# EAGLE board car (EAGLE 6.5.0)
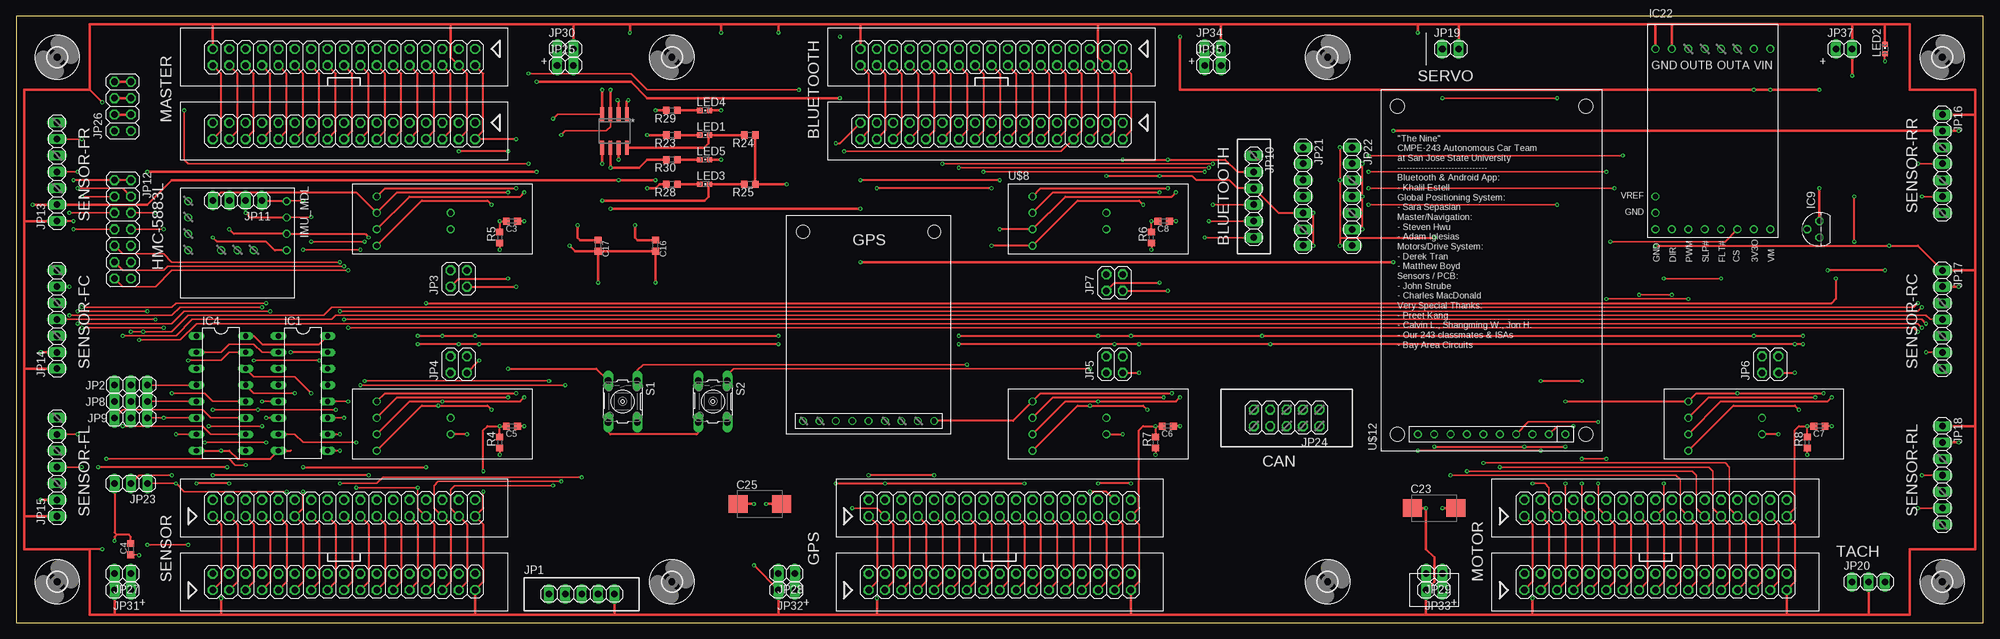
[diagram p5: board, top side]
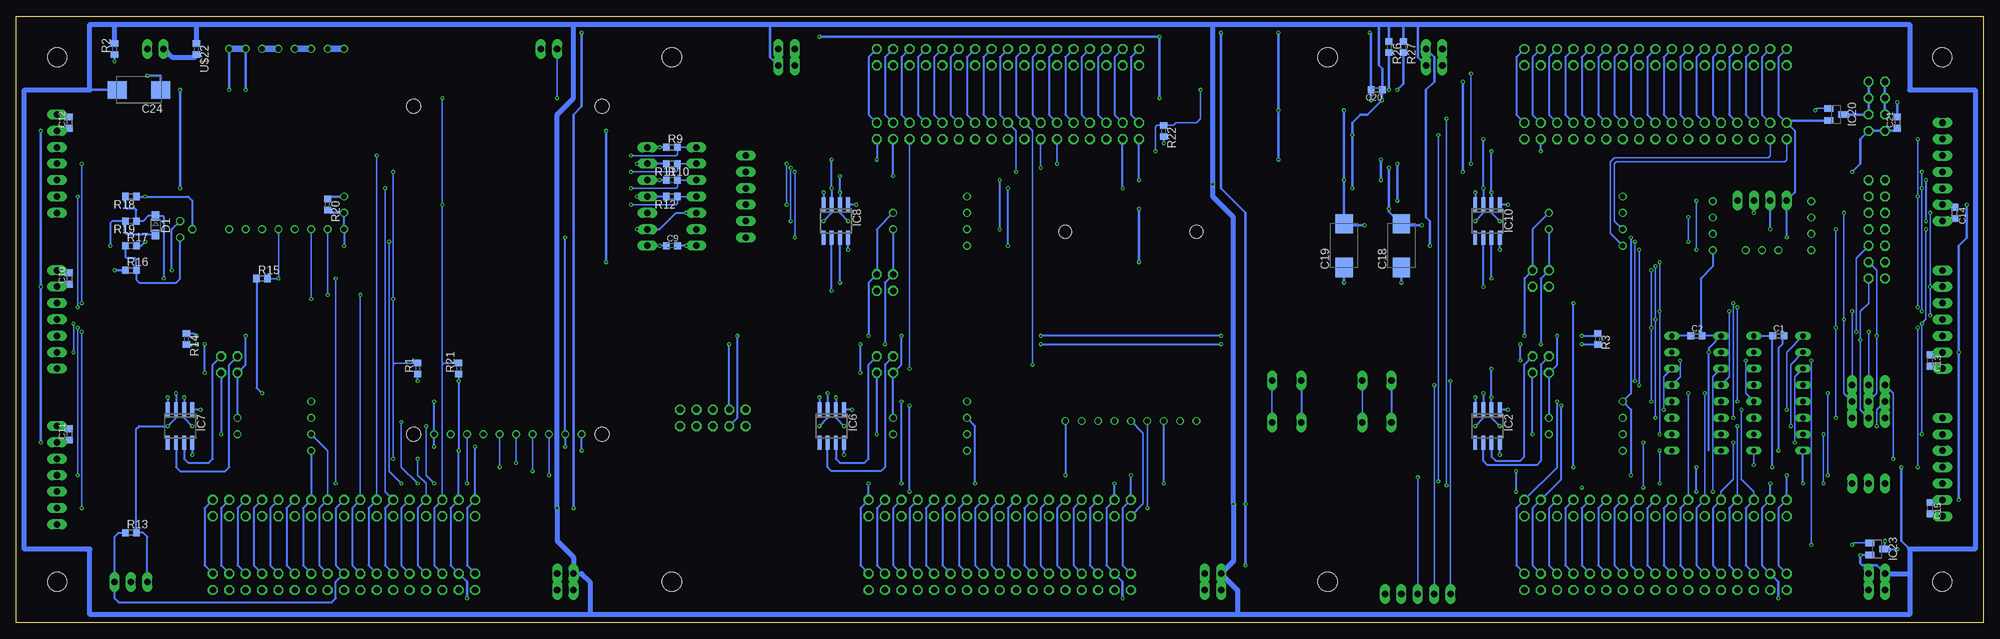
[diagram p6: board, bottom side, seen from below]

Size 304.8 x 93.98 mm. Coordinates in mm from the lower left corner, seen from the top.
Outline: 0,0 304.8,0 304.8,93.98 0,93.98 0,0
Copper layers (1*16): Top 0.0356mm / dielectric 1.5011mm / Bottom 0.0356mm
Design rules "LaenPCBOrder *": minimum track width 8mil, minimum drill 10mil, track to track 6mil, track to pad 6mil, pad to pad 6mil, via to via 6mil, smd to smd 6mil, copper to edge 15mil, drill to drill 6mil, minimum pad ring 7mil, minimum via ring 7mil, stop-mask expansion 3mil, vias tented up to drill 0mil, thermal gap 10mil

## Footprints (pad centres in the part's own frame; a part is rotated, then mirrored left to right if it is on the bottom)
C0603K = smd 1.05 x 1.08: 1 -0.875,0; 2 0.875,0
D/7343-31W = smd 2.95 x 2.7: + 3.375,0; - -3.375,0
SOD323-W = smd 1.5 x 1.2: A 1.45,0; C -1.45,0
3,0 = hole 3: 0,0
DIL16 = drill 0.813 long: 1 -8.89,-3.81; 2 -6.35,-3.81; 3 -3.81,-3.81; 4 -1.27,-3.81; 5 1.27,-3.81; 6 3.81,-3.81; 7 6.35,-3.81; 8 8.89,-3.81; 9 8.89,3.81; 10 6.35,3.81; 11 3.81,3.81; 12 1.27,3.81; 13 -1.27,3.81; 14 -3.81,3.81; 15 -6.35,3.81; 16 -8.89,3.81
SOIC8 = smd 0.6 x 2.2: 1 -1.905,-2.6; 2 -0.635,-2.6; 3 0.635,-2.6; 4 1.905,-2.6; 5 1.905,2.6; 6 0.635,2.6; 7 -0.635,2.6; 8 -1.905,2.6
TO-92 = drill 0.813 octagon: 1 -1.27,0; 2 0,1.905; 3 1.27,0
SOT23-3 = smd 1 x 1.4: 1 -0.95,-1.1; 2 0.95,-1.1; 3 0,1.1
24V21 = drill 0.813: 1 19.05,1.27; 2 16.51,1.27; 3 13.97,1.27; 4 11.43,1.27; 5 8.89,1.27; 6 6.35,1.27; 7 3.81,1.27; 8 1.27,1.27; 9 1.27,3.81; 10 1.27,6.35; 11 1.27,29.21; 12 3.81,29.21; 13 6.35,29.21; 14 8.89,29.21; 15 11.43,29.21; 16 13.97,29.21; 17 16.51,29.21; 18 19.05,29.21
MPU9250 = drill 0.813: P1 -2.461,8.255; P2 0.079,8.255; P3 2.619,8.255; P4 5.159,8.255; P5 5.159,3.175; P6 5.159,0.635; P7 5.159,-1.905; P8 5.159,-6.985; P9 2.619,-6.985; P10 0.079,-6.985; P11 -2.461,-6.985
1X05 = drill 1.016 long: 1 -5.08,0; 2 -2.54,0; 3 0,0; 4 2.54,0; 5 5.08,0
1X03 = drill 1.016 long: 1 -2.54,0; 2 0,0; 3 2.54,0
2X02 = drill 1.016 octagon: 1 -1.27,-1.27; 2 -1.27,1.27; 3 1.27,-1.27; 4 1.27,1.27
1X06 = drill 1.016 long: 1 -6.35,0; 2 -3.81,0; 3 -1.27,0; 4 1.27,0; 5 3.81,0; 6 6.35,0
1X04 = drill 1.016 long: 1 -3.81,0; 2 -1.27,0; 3 1.27,0; 4 3.81,0
2X07 = drill 1.016 octagon: 1 -7.62,-1.27; 2 -7.62,1.27; 3 -5.08,-1.27; 4 -5.08,1.27; 5 -2.54,-1.27; 6 -2.54,1.27; 7 0,-1.27; 8 0,1.27; 9 2.54,-1.27; 10 2.54,1.27; 11 5.08,-1.27; 12 5.08,1.27; 13 7.62,-1.27; 14 7.62,1.27
1X07 = drill 1.016 long: 1 -7.62,0; 2 -5.08,0; 3 -2.54,0; 4 0,0; 5 2.54,0; 6 5.08,0; 7 7.62,0
1X02 = drill 1.016 long: 1 -1.27,0; 2 1.27,0
2X05 = drill 1.016 octagon: 1 -5.08,-1.27; 2 -5.08,1.27; 3 -2.54,-1.27; 4 -2.54,1.27; 5 0,-1.27; 6 0,1.27; 7 2.54,-1.27; 8 2.54,1.27; 9 5.08,-1.27; 10 5.08,1.27
2X04 = drill 1.016 octagon: 1 -3.81,-1.27; 2 -3.81,1.27; 3 -1.27,-1.27; 4 -1.27,1.27; 5 1.27,-1.27; 6 1.27,1.27; 7 3.81,-1.27; 8 3.81,1.27
CHIPLED_0603 = smd 0.8 x 0.8: A 0,-0.75; C 0,0.75
R0603 = smd 1 x 1.1: 1 -0.85,0; 2 0.85,0
B3F-10XX = drill 1.016 long: 1 -3.251,2.261; 2 3.251,2.261; 3 -3.251,-2.261; 4 3.251,-2.261
WAVESHARE-CAN = drill 0.813: 1 -6.35,3.81; 2 -6.35,1.27; 3 -6.35,-1.27; 4 -6.35,-3.81; 5 5.08,1.27; 6 5.08,-1.27
ADA-TFT = drill 0.813: 1 -26.67,11.43; 2 -26.67,8.89; 3 -26.67,6.35; 4 -26.67,3.81; 5 -26.67,1.27; 6 -26.67,-1.27; 7 -26.67,-3.81; 8 -26.67,-6.35; 9 -26.67,-8.89; 10 -26.67,-11.43 | hole 2.2: -26.67,14.605; -26.67,-14.605; 24.13,-14.605; 24.13,14.605
ADA-GPS = drill 0.8: P1 -14.446,-10.16; P2 -14.446,-7.62; P3 -14.446,-5.08; P4 -14.446,-2.54; P5 -14.446,0; P6 -14.446,2.54; P7 -14.446,5.08; P8 -14.446,7.62; P9 -14.446,10.16 | hole 2: 14.859,10.16; 14.859,-10.16
SJ1_CONN = drill 1.016 octagon: 1 -20.32,-1.27; 2 -20.32,1.27; 3 -17.78,-1.27; 4 -17.78,1.27; 5 -15.24,-1.27; 6 -15.24,1.27; 7 -12.7,-1.27; 8 -12.7,1.27; 9 -10.16,-1.27; 10 -10.16,1.27; 11 -7.62,-1.27; 12 -7.62,1.27; 13 -5.08,-1.27; 14 -5.08,1.27; 15 -2.54,-1.27; 16 -2.54,1.27; 17 0,-1.27; 18 0,1.27; 19 2.54,-1.27; 20 2.54,1.27; 21 5.08,-1.27; 22 5.08,1.27; 23 7.62,-1.27; 24 7.62,1.27; 25 10.16,-1.27; 26 10.16,1.27; 27 12.7,-1.27; 28 12.7,1.27; 29 15.24,-1.27; 30 15.24,1.27; 31 17.78,-1.27; 32 17.78,1.27; 33 20.32,-1.27; 34 20.32,1.27
R0605 = smd 1 x 1.1: 1 -0.85,0; 2 0.85,0

## Placement (x,y rotation side)
C1  0.1uF  [C0603K]  31.75,44.45 0 bottom
C2  0.1uF  [C0603K]  44.45,44.45 0 bottom
C3  0.1uF  [C0603K]  76.83,62.23 180 top
C4  0.1uF  [C0603K]  17.78,11.43 90 top
C5  0.1uF  [C0603K]  76.83,30.48 180 top
C6  0.1uF  [C0603K]  178.44,30.48 180 top
C7  0.1uF  [C0603K]  279.4,30.48 180 top
C8  0.1uF  [C0603K]  177.8,62.23 180 top
C9  0.1uF  [C0603K]  203.2,58.42 0 bottom
C10  0.1uF  [C0603K]  296.55,53.34 90 bottom
C11  0.1uF  [C0603K]  296.55,29.21 90 bottom
C12  0.1uF  [C0603K]  296.55,77.47 90 bottom
C13  0.1uF  [C0603K]  8.26,40.64 270 bottom
C14  0.1uF  [C0603K]  4.45,63.5 270 bottom
C15  0.1uF  [C0603K]  8.26,17.78 270 bottom
C16  0.1uF  [C0603K]  99.06,58.42 270 top
C17  0.1uF  [C0603K]  90.17,58.42 270 top
C18  22uF  [D/7343-31W]  90.17,58.42 90 bottom
C19  22uF  [D/7343-31W]  99.06,58.42 90 bottom
C20  0.1uF  [C0603K]  93.98,82.55 180 bottom
C21  0.1uF  [C0603K]  13.34,77.47 90 bottom
C23  22uF  [D/7343-31W]  219.71,17.78 0 top
C24  22uF  [D/7343-31W]  285.75,82.55 180 bottom
C25  22uF  [D/7343-31W]  115.25,18.41 0 top
D1  BZT52HC3V3WF-7  [SOD323-W]  283.21,61.59 270 bottom
H1  MOUNT-HOLE3.0  [3,0]  203.2,6.35 0 top
H5  MOUNT-HOLE3.0  [3,0]  6.35,6.35 0 top
H6  MOUNT-HOLE3.0  [3,0]  6.35,87.63 0 top
H7  MOUNT-HOLE3.0  [3,0]  298.45,87.63 0 top
H8  MOUNT-HOLE3.0  [3,0]  298.45,6.35 0 top
H10  MOUNT-HOLE3.0  [3,0]  101.6,6.35 0 top
H11  MOUNT-HOLE3.0  [3,0]  101.6,87.63 0 top
H12  MOUNT-HOLE3.0  [3,0]  203.2,87.63 0 top
IC1  74HCT253N  [DIL16]  44.45,35.56 270 top
IC2  SN65HVD230  [SOIC8]  76.83,30.48 180 bottom
IC4  74HCT259N  [DIL16]  31.75,35.56 270 top
IC6  SN65HVD230  [SOIC8]  178.44,30.48 180 bottom
IC7  SN65HVD230  [SOIC8]  279.4,30.48 180 bottom
IC8  SN65HVD230  [SOIC8]  177.8,62.23 180 bottom
IC9  LM431-TO92  [TO-92]  279.4,60.96 90 top
IC10  SN65HVD230  [SOIC8]  76.83,62.23 180 bottom
IC20  FDN335N  [SOT23-3]  22.86,78.74 270 bottom
IC21  TPS2042  [SOIC8]  92.71,76.2 180 top
IC22  24V21  [24V21]  252.73,59.69 0 top
IC23  MCP130-SOT23  [SOT23-3]  16.51,11.43 270 bottom
IMU_MDL  MPU9250  [MPU9250]  33.66,62.87 270 top
JP1  SJ1_AUX  [1X05]  87.63,4.45 0 top
JP2  L_SEL  [1X03]  17.78,36.83 0 top
JP3  CAN_EN  [2X02]  68.58,53.34 0 top
JP4  CAN_EN  [2X02]  68.58,40.01 180 top
JP5  CAN_EN  [2X02]  170.18,40.01 180 top
JP6  CAN_EN  [2X02]  271.78,40.01 180 top
JP7  CAN_EN  [2X02]  170.18,52.7 0 top
JP8  C_SEL  [1X03]  17.78,34.29 0 top
JP9  R_SEL  [1X03]  17.78,31.75 0 top
JP10  BT_MDL  [1X06]  191.77,66.04 270 top
JP11  HMC_CON  [1X04]  34.29,65.41 180 top
JP12  US_DBG  [2X07]  16.51,60.96 270 top
JP13  SFL  [1X07]  6.35,69.85 90 top
JP14  SFC  [1X07]  6.35,46.99 90 top
JP15  SFR  [1X07]  6.35,24.13 90 top
JP16  SRL  [1X07]  298.45,71.12 270 top
JP17  SRC  [1X07]  298.45,46.99 270 top
JP18  SRR  [1X07]  298.45,22.86 270 top
JP19  SERVO  [1X02]  222.25,88.9 0 top
JP20  TACH  [1X03]  287.02,6.35 0 top
JP21  TEST1  [1X07]  199.39,66.04 270 top
JP22  TEST2  [1X07]  207.01,66.04 270 top
JP23  TEST  [1X03]  17.78,21.59 180 top
JP24  CAN  [2X05]  196.85,31.75 180 top
JP25  MST_PWR  [1X02]  85.09,86.36 0 top
JP26  LITE  [2X04]  16.51,80.01 90 top
JP27  SNS_PWR  [1X02]  16.51,7.62 180 top
JP28  GPS_PWR  [1X02]  119.38,7.62 180 top
JP29  MTR_PWR  [1X02]  219.71,7.62 180 top
JP30  MST_PWR  [1X02]  85.09,88.9 0 top
JP31  SNS_PWR  [1X02]  16.51,5.08 180 top
JP32  GPS_PWR  [1X02]  119.38,5.08 180 top
JP33  MTR_PWR  [1X02]  219.71,5.08 180 top
JP34  BT_PWR  [1X02]  185.42,88.9 0 top
JP35  BT_PWR  [1X02]  185.42,86.36 0 top
JP37  DC5V_IN  [1X02]  283.21,88.9 0 top
LED1  OCF#  [CHIPLED_0603]  106.68,75.56 270 top
LED2  RED  [CHIPLED_0603]  289.56,88.9 0 top
LED3  OCR#  [CHIPLED_0603]  106.68,67.94 270 top
LED4  PWF  [CHIPLED_0603]  106.68,79.38 270 top
LED5  PWR  [CHIPLED_0603]  106.68,71.75 270 top
R1  4.7K  [R0603]  242.57,39.37 90 bottom
R2  330  [R0603]  289.56,88.9 90 bottom
R3  120  [R0603]  59.74,43.99 270 bottom
R4  10K  [R0603]  74.93,27.94 90 top
R5  10K  [R0603]  74.93,59.69 90 top
R6  10K  [R0603]  175.9,59.69 90 top
R7  10K  [R0603]  176.53,27.94 90 top
R8  10K  [R0603]  277.5,27.94 90 top
R9  10K  [R0603]  203.2,73.66 0 bottom
R10  10K  [R0603]  203.2,68.58 0 bottom
R11  10K  [R0603]  203.2,71.12 180 bottom
R12  10K  [R0603]  203.2,66.04 180 bottom
R13  10K  [R0603]  287.02,13.97 0 bottom
R14  120  [R0603]  278.41,43.97 270 bottom
R15  10K  [R0603]  266.7,53.34 0 bottom
R16  2K61  [R0603]  287.02,54.61 0 bottom
R17  1K  [R0603]  287.02,58.42 0 bottom
R18  60.4  [R0603]  287.02,66.04 180 bottom
R19  649  [R0603]  287.02,62.23 180 bottom
R20  30K  [R0603]  256.54,64.77 270 bottom
R21  4.7K  [R0603]  236.22,39.37 90 bottom
R22  4.7K  [R0603]  127,76.2 270 bottom
R23  330  [R0603]  101.6,75.56 180 top
R24  4.7K  [R0603]  113.67,75.56 180 top
R25  4.7K  [R0603]  113.67,67.94 180 top
R26  4.7K  [R0603]  92.08,89.22 270 bottom
R27  4.7K  [R0603]  89.85,89.22 270 bottom
R28  330  [R0603]  101.6,67.94 180 top
R29  330  [R0603]  101.6,79.38 180 top
R30  330  [R0603]  101.6,71.75 180 top
S1  B3F-1052  [B3F-10XX]  93.98,34.29 270 top
S2  B3F-1052  [B3F-10XX]  107.95,34.29 270 top
U$7  WAVESHARE-CAN  [WAVESHARE-CAN]  62.23,62.23 0 top
U$8  WAVESHARE-CAN  [WAVESHARE-CAN]  163.83,62.23 0 top
U$9  WAVESHARE-CAN  [WAVESHARE-CAN]  62.23,30.48 0 top
U$10  WAVESHARE-CAN  [WAVESHARE-CAN]  163.83,30.48 0 top
U$11  WAVESHARE-CAN  [WAVESHARE-CAN]  265.43,30.48 0 top
U$12  TFT_MDL  [ADA-TFT]  228.6,55.88 90 top
U$13  GPS_MDL  [ADA-GPS]  132.08,45.72 90 top
U$19  SJ1_CONN  [SJ1_CONN]  50.8,17.78 0 top
U$20  SJ1_CONN  [SJ1_CONN]  50.8,6.35 0 top
U$22  PTC-FUSE-0605  [R0605]  276.86,88.9 270 bottom
U$23  SJ1_CONN  [SJ1_CONN]  50.8,87.63 180 top
U$24  SJ1_CONN  [SJ1_CONN]  50.8,76.2 180 top
U$25  SJ1_CONN  [SJ1_CONN]  254,17.78 0 top
U$26  SJ1_CONN  [SJ1_CONN]  254,6.35 0 top
U$27  SJ1_CONN  [SJ1_CONN]  151.13,87.63 180 top
U$28  SJ1_CONN  [SJ1_CONN]  152.4,17.78 0 top
U$29  SJ1_CONN  [SJ1_CONN]  152.4,6.35 0 top
U$30  SJ1_CONN  [SJ1_CONN]  151.13,76.2 180 top

## Tracks (layer width: path | path; a pad name or v marks a point on that pad's centre or on a via)
@CAN_H  (via drill 0.25)
  Top 0.305: v76.2,53.34 68.58,53.34 JP3.1
  Bottom 0.305: v76.2,53.34 IC10.7
@CAN_H1
  Bottom 0.305: JP4.1 71.12,40.01 71.12,25.72 71.75,25.08 75.56,25.08 76.2,25.72 IC2.7
@CAN_H2
  Bottom 0.305: IC6.7 177.8,25.4 177.16,24.77 173.35,24.77 172.72,25.4 172.72,40.01 JP5.1
@CAN_H3
  Bottom 0.305: IC7.7 278.76,25.4 278.13,24.77 274.95,24.77 274.32,25.4 274.32,40.01 JP6.1
@CAN_H4  (via drill 0.25)
  Top 0.305: JP7.1 170.18,52.7 v177.16,52.7
  Bottom 0.305: v177.16,52.7 IC8.7
@CAN_L  (via drill 0.25)
  Top 0.305: JP3.3 v77.47,52.07
  Bottom 0.305: v77.47,52.07 IC10.6
@CAN_L1
  Bottom 0.305: JP4.3 68.58,40.01 68.58,25.08 69.22,24.45 76.83,24.45 77.47,25.08 IC2.6
@CAN_L2
  Bottom 0.305: JP5.3 170.18,40.01 170.18,24.13 170.81,23.5 178.44,23.5 179.07,24.13 IC6.6
@CAN_L3
  Bottom 0.305: IC7.6 280.04,24.13 279.4,23.5 272.42,23.5 271.78,24.13 271.78,40.01 JP6.3
@CAN_L4  (via drill 0.25)
  Top 0.305: JP7.3 v178.44,51.44
  Bottom 0.305: v178.44,51.44 IC8.6
@SRC_TRG  (via drill 0.25)
  Top 0.203: IC4.10 30.16,29.21 28.89,30.48 v16.51,30.48
  Bottom 0.203: v16.51,30.48 16.51,33.02 JP8.1
@SRL_TRG  (via drill 0.25)
  Top 0.203: v13.97,25.4 33.02,25.4 33.97,24.45 v35.56,24.45
  Bottom 0.203: v13.97,25.4 13.97,35.56 JP2.1 | v35.56,24.45 IC4.9
@SRR_TRG
  Top 0.203: IC4.11 30.16,31.75 28.89,33.02 16.51,33.02 JP9.1
BAT_IN  (via drill 0.25)
  Top 0.305: v289.56,54.61 v280.67,54.61
  Top 0.406: v180.34,90.81 180.34,82.55 v269.24,82.55 v271.78,82.55 v279.4,82.55 | v279.4,67.31 IC9.3 | v20.32,69.85 v80.64,69.85 | v80.64,83.82 95.25,83.82 97.79,81.28 v127.64,81.28
  Bottom 0.305: v280.67,54.61 280.67,60.96 IC9.3
  Bottom 0.406: R16.1 v289.56,54.61 | v20.32,69.85 19.05,71.12 19.05,74.93 JP26.1 JP26.2 13.73,76.2 C21.1 | v180.34,90.81 v127.64,90.81 v127.64,81.28 | IC22.18 v271.78,82.55 | v279.4,82.55 v279.4,67.31 | v80.64,69.85 v80.64,83.82 | IC22.17 v269.24,82.55
  Bottom 1.016: IC22.17 IC22.18
BAT_LEVEL  (via drill 0.25)
  Top 0.305: U$20.11 44.45,6.35 44.45,15.24 U$19.11 44.45,17.78 v44.45,20.32 | v44.45,24.13 v63.5,24.13 | v63.5,49.53 281.31,49.53 281.94,50.16 v281.94,53.34
  Bottom 0.305: v44.45,20.32 v44.45,24.13 | v63.5,24.13 v63.5,49.53 | R18.2 287.87,64.35 287.65,64.14 286.38,64.14 286.17,63.92 R19.1 285.12,62.23 284.3,63.05 D1.C 282.12,63.05 281.94,62.87 v281.94,53.34
BT_3V3  (via drill 0.25)
  Top 0.305: U$27.2 172.72,85.09 172.72,76.2 U$30.2 | v171.45,71.75 v178.44,71.75 187.32,71.75 189.23,69.85 JP10.2 | U$8.1 158.75,67.31 v178.44,67.31 | v179.71,62.23 C8.1
  Bottom 0.305: U$30.2 v171.45,71.75 | v179.71,62.23 178.44,63.5 IC8.3 v178.44,67.31 v178.44,71.75
BT_BTN_HOME  (via drill 0.25)
  Top 0.203: S1.1 96.24,39.09 97.16,40.01 v147.32,40.01
  Bottom 0.203: S1.1 S1.2 | v147.32,40.01 147.32,76.2 U$30.19
  Bottom 0.305: U$27.19 149.86,87.63 149.86,78.74 U$30.19
BT_BTN_LITE  (via drill 0.25)
  Top 0.203: S2.1 110.21,38.46 111.12,39.37 v166.37,39.37
  Top 0.305: U$27.6 167.64,85.09 167.64,76.2 U$30.6
  Bottom 0.203: S2.1 S2.2 | v166.37,39.37 U$30.6
BT_CAN_RX  (via drill 0.25)
  Top 0.305: U$27.34 132.08,85.09 132.08,76.2 U$30.34 | v179.71,66.67 179.07,66.04 162.56,66.04 U$8.3 v152.4,60.96 | v152.4,68.58 v130.81,68.58
  Bottom 0.305: v179.71,66.67 IC8.4 | v152.4,60.96 v152.4,68.58 | v130.81,68.58 U$30.34
BT_CAN_TX  (via drill 0.25)
  Top 0.305: U$27.32 134.62,85.09 134.62,76.2 U$30.32 | v174.62,64.77 173.99,65.41 164.47,65.41 U$8.4 v151.13,58.42 | v151.13,67.31 v133.35,67.31
  Bottom 0.305: v174.62,64.77 175.84,64.77 IC8.1 | v151.13,58.42 v151.13,67.31 | v133.35,67.31 U$30.32
BT_MDL_RXDI  (via drill 0.25)
  Top 0.203: JP10.5 v184.78,62.23 | v184.78,70.48 v146.05,70.48
  Top 0.305: U$27.22 147.32,85.09 147.32,76.2 U$30.22
  Bottom 0.203: v184.78,62.23 v184.78,70.48 | v146.05,70.48 U$30.22
BT_MDL_STATE  (via drill 0.25)
  Top 0.203: JP10.6 v184.15,59.69 | v184.15,69.85 v149.86,69.85
  Bottom 0.203: v184.15,59.69 v184.15,69.85 | v149.86,69.85 149.86,76.2 U$30.17
  Bottom 0.305: U$27.17 152.4,87.63 152.4,78.74 U$30.17
BT_MDL_TXDO  (via drill 0.25)
  Top 0.203: JP10.4 v185.42,64.77 | v185.42,71.12 v143.51,71.12
  Top 0.305: U$27.24 144.78,85.09 144.78,76.2 U$30.24
  Bottom 0.203: v185.42,64.77 v185.42,71.12 | v143.51,71.12 U$30.24
CAN_H  (via drill 0.25)
  Top 0.305: v276.86,43.18 v275.59,43.18 v194.31,43.18 v173.99,43.18 v170.18,43.18 v146.05,43.18 | v62.23,43.18 v68.58,43.18 v71.75,43.18 v118.11,43.18 | v69.85,29.21 U$9.6 | JP4.2 v71.75,40.64 | U$10.6 v171.45,29.21 | JP5.2 v173.99,38.73 | v273.05,29.21 U$11.6 | JP6.2 v275.59,38.73
  Bottom 0.305: v62.23,43.18 59.78,43.18 R3.2 | U$7.6 JP3.2 68.58,53.34 v68.58,43.18 | v69.85,29.21 JP4.2 | v71.75,40.64 v71.75,43.18 | v171.45,29.21 JP5.2 | v173.99,38.73 v173.99,43.18 | JP6.2 v273.05,29.21 | v275.59,38.73 v275.59,43.18 | U$8.6 JP7.2 170.18,52.7 v170.18,43.18 | JP24.7 v194.31,43.18 | R14.2 276.92,43.12 v276.86,43.18 | v146.05,43.18 v118.11,43.18
CAN_L  (via drill 0.25)
  Top 0.305: v62.23,44.45 v66.04,44.45 v71.12,44.45 v118.11,44.45 | v276.86,44.45 v269.24,44.45 v193.04,44.45 v172.72,44.45 v167.64,44.45 v146.05,44.45
  Bottom 0.305: v62.23,44.45 60.33,44.45 59.69,45.09 59.69,44.89 R3.1 | U$7.5 69.85,60.96 JP3.4 71.12,53.34 v71.12,44.45 | U$9.5 JP4.4 66.04,40.01 v66.04,44.45 | U$10.5 JP5.4 167.64,40.01 v167.64,44.45 | U$11.5 JP6.4 269.24,40.01 v269.24,44.45 | U$8.5 171.45,60.96 JP7.4 172.72,52.7 v172.72,44.45 | JP24.8 193.04,31.75 v193.04,44.45 | v276.86,44.45 277.23,44.82 R14.1 | v118.11,44.45 v146.05,44.45
EXT_VCC
  Bottom 0.813: JP37.1 280.67,87.63 277.07,87.63 U$22.2
GND  (via drill 0.25)
  Top 0.305: v33.02,21.59 v27.94,21.59 | IMU_MDL.P4 40.08,57.71 38.73,59.05 31.11,59.05 v30.48,59.69 | U$24.4 69.85,76.2 69.85,85.09 U$23.4 | U$20.33 72.39,6.35 72.39,15.24 U$19.33 72.39,17.78 v72.39,20.32 | U$29.33 173.99,6.35 173.99,15.24 U$28.33 173.99,17.78 173.99,29.84 174.62,30.48 v176.53,30.48 | U$27.4 170.18,85.09 170.18,76.2 U$30.4 | v127,21.59 v134.62,21.59 v156.21,21.59 | v168.91,69.22 v177.16,69.22 182.25,69.22 182.88,68.58 187.96,68.58 189.23,67.31 JP10.3 195.58,63.5 JP21.5 | IC4.8 v31.75,26.67 33.02,26.67 34.29,25.4 39.37,25.4 IC1.8 42.55,26.67 | v236.22,26.67 v217.17,26.67 | U$26.33 275.59,6.35 275.59,15.24 U$25.33 275.59,17.78 275.59,29.84 276.23,30.48 v277.5,30.48 | v76.2,66.67 59.05,66.67 U$7.2 52.7,66.67 31.75,66.67 JP11.4 | C3.2 v74.93,62.23 R5.2 | v76.2,73.03 v68.58,73.03 | U$9.2 59.05,34.92 v76.2,34.92 | v74.93,30.48 C5.2 | R4.2 v74.93,30.48 | S1.4 91.72,29.57 92.08,29.21 105.41,29.21 105.69,29.49 S2.4 | U$10.2 160.66,34.92 v177.8,34.92 | v176.53,30.48 C6.2 | v176.53,30.48 R7.2 | U$11.2 262.25,34.92 v278.76,34.92 | v277.5,30.48 C7.2 | R8.2 v277.5,30.48 | U$8.2 160.66,66.67 v177.16,66.67 | C8.2 v175.9,62.23 R6.2 | v74.93,30.48 73.03,30.48 72.39,29.84 v72.39,23.5 | v76.2,39.37 89.89,39.37 S1.3 | v236.22,37.47 v242.57,37.47 | JP17.1 294.64,58.42 v290.19,58.42 v254,58.42 | v13.34,11.43 11.43,11.43 | C4.2 17.78,13.34 17.46,13.65 15.56,13.65 | 15.56,13.65 15.24,13.34 v15.24,12.7 | JP12.2 JP12.1 v8.89,68.58 | v8.89,62.23 JP13.1 | IC1.15 v42.55,41.91 | v208.6,60.96 v208.6,66.04 v208.6,71.12 | v200.98,58.42 v200.98,63.5 | JP23.3 15.24,13.97 15.56,13.65 | v127,74.3 127.64,74.3 U$30.33
  Top 0.406: JP13.1 1.27,62.23 | 1.27,62.23 1.27,39.37 | 1.27,39.37 1.27,16.51 | 1.27,16.51 1.27,11.43 11.43,11.43 11.43,1.27 15.24,1.27 | 15.24,1.27 31.75,1.27 | 31.75,1.27 71.12,1.27 | 71.12,1.27 92.71,1.27 | 92.71,1.27 118.11,1.27 | 118.11,1.27 133.35,1.27 | 133.35,1.27 172.72,1.27 | 172.72,1.27 218.44,1.27 | 218.44,1.27 234.95,1.27 | 234.95,1.27 274.32,1.27 | 274.32,1.27 287.02,1.27 | 287.02,1.27 293.37,1.27 293.37,11.43 303.53,11.43 303.53,30.48 | 303.53,30.48 303.53,54.61 | 303.53,54.61 303.53,78.74 | 303.53,78.74 303.53,82.55 293.37,82.55 293.37,92.71 289.56,92.71 | 289.56,92.71 284.48,92.71 | 284.48,92.71 256.54,92.71 | 256.54,92.71 254,92.71 | 254,92.71 223.52,92.71 | 223.52,92.71 217.17,92.71 | 217.17,92.71 186.69,92.71 | 186.69,92.71 167.64,92.71 | 167.64,92.71 130.81,92.71 | 130.81,92.71 118.11,92.71 | 118.11,92.71 109.22,92.71 | 109.22,92.71 95.09,92.71 | 95.09,92.71 86.36,92.71 | 86.36,92.71 67.31,92.71 | 67.31,92.71 30.48,92.71 | 30.48,92.71 11.43,92.71 11.43,82.55 | 11.43,82.55 1.27,82.55 1.27,62.23 | JP14.1 1.27,39.37 | JP15.1 1.27,16.51 | JP16.1 303.53,78.74 | JP17.1 303.53,54.61 | JP18.1 303.53,30.48 | U$23.33 30.48,92.71 | U$23.4 67.31,87.63 67.31,92.71 | U$20.33 71.12,1.27 | v31.75,3.81 31.75,1.27 | JP34.2 186.69,92.71 | 284.48,92.71 JP37.2 v284.48,84.77 | JP30.2 86.36,92.71 | 218.44,1.27 JP33.2 219.71,6.35 219.71,10.16 218.44,11.43 v218.44,17.78 C23.- | 118.11,1.27 JP32.2 v114.3,8.89 | JP31.2 15.24,1.27 | v133.35,3.81 133.35,1.27 | v234.95,3.81 234.95,1.27 | U$27.4 167.64,87.63 167.64,92.71 | U$27.33 130.81,92.71 | U$26.33 274.32,1.27 | IC22.12 256.54,92.71 | JP19.2 223.52,92.71 | U$29.33 172.72,1.27 | v118.11,91.44 118.11,92.71 | v217.17,91.44 217.17,92.71
  Top 0.406: LED2.C 289.56,92.71 | JP1.5 92.71,1.27 | JP20.2 287.02,1.27 | v95.09,91.44 95.09,92.71 | v109.22,79.38 LED4.C | LED5.C v109.22,71.75 | v109.22,91.44 109.22,92.71 | C17.2 C16.2 v99.06,52.7 | C17.2 v90.17,52.7 | C17.2 86.6,57.55 v85.72,58.42 | IC21.1 94.61,80.72 v94.86,80.96 | IC22.11 254,92.71 | 11.43,82.55 v13.34,80.64 | C25.- v114.3,18.41
  Bottom 0.305: v27.94,21.59 IC4.8 | v30.48,59.69 JP11.4 29.21,66.67 29.21,76.2 U$24.33 31.75,78.74 31.75,87.63 U$23.33 | U$20.4 34.29,8.89 34.29,17.78 U$19.4 v33.02,21.59 | U$26.4 237.49,8.89 237.49,17.78 U$25.4 v236.22,26.67 v236.22,37.47 R21.1 | U$29.4 135.89,8.89 135.89,17.78 U$28.4 v134.62,21.59 | U$27.33 132.08,87.63 132.08,78.74 U$30.33 | U$13.P7 v127,21.59 | v168.91,69.22 U$30.4 | 31.11,44.45 31.11,44.13 | 31.11,44.13 31.11,43.18 31.75,42.55 v31.75,26.67 | v217.17,26.67 U$12.1 | v74.93,62.23 76.2,63.5 IC10.2 v76.2,66.67 v76.2,73.03 | v68.58,73.03 U$24.4 | v74.93,30.48 76.2,31.75 IC2.2 v76.2,34.92 v76.2,39.37 | S1.3 S1.4 | S2.3 S2.4 | v177.8,34.92 177.8,33.66 | v156.21,21.59 156.21,30.48 U$10.2 | IC6.2 177.8,31.75 v176.53,30.48 | v278.76,34.92 IC7.2 278.76,31.75 v277.5,30.48 | v175.9,62.23 177.16,63.5 IC8.2 v177.16,66.67 v177.16,69.22 | v242.57,37.47 R1.1 | IC22.9 IC22.8 v254,58.42 | v13.34,11.43 IC23.3 15.24,11.43 v15.24,12.7 | C1.2 30.88,44.37 31.11,44.13 | v8.89,68.58 v8.89,62.23 | IMU_MDL.P4 41.91,55.24 43.81,53.34 43.81,44.45 C2.2 IC1.1 42.55,42.55 v42.55,41.91 42.55,26.67 | R12.2 JP22.4 v208.6,66.04 | C9.2 v200.98,58.42 JP21.7 | JP21.5 v200.98,63.5 202.56,63.5 205.1,60.96 JP22.6 v208.6,60.96 | R11.2 JP22.2 v208.6,71.12 | R22.2 v127,74.3 | v72.39,20.32 v72.39,23.5 | D1.A 287.48,60.15 287.97,60.64 287.97,62.13 R19.2 289.88,62.23 290.19,61.91 v290.19,58.42
  Bottom 0.406: U$20.4 31.75,6.35 v31.75,3.81 | U$29.4 133.35,6.35 v133.35,3.81 | U$26.4 234.95,6.35 v234.95,3.81 | v118.11,91.44 118.11,67.31 114.3,63.5 v114.3,18.41 v114.3,8.89 | v218.44,17.78 218.44,78.74 217.17,80.01 v217.17,91.44 | IC22.9 256.12,63.5 R20.2 | IC20.2 30.16,77.79 U$24.33 | v95.09,91.44 94.86,91.2 C20.2 v94.86,80.96 | v109.22,79.38 v109.22,71.75 v109.22,91.44 | v90.17,52.7 C18.- | v99.06,52.7 C19.- | v85.72,58.42 85.72,62.23 86.36,62.87 86.36,82.55 85.09,83.82 85.09,87.63 JP30.2 | JP16.1 296.94,78.74 C12.2 | C10.2 296.94,54.61 JP17.1 | C11.2 296.94,30.48 JP18.1 | C15.2 7.86,16.51 JP15.1 | C13.2 7.86,39.37 JP14.1 | JP13.1 4.84,62.23 C14.2 | v13.34,80.64 C21.2 | v284.48,84.77 282.38,84.77 C24.-
  Bottom 1.016: IC22.11 IC22.12
GPS_3V3  (via drill 0.25)
  Top 0.305: v142.24,22.86 v132.08,22.86 | v179.07,35.56 158.75,35.56 U$10.1 154.46,31.27 U$13.P1 | v180.34,30.48 C6.1
  Bottom 0.305: U$29.2 133.35,8.89 133.35,17.78 U$28.2 v132.08,22.86 | U$13.P1 v142.24,22.86 | v179.07,35.56 IC6.3 179.07,31.75 v180.34,30.48
GPS_CAN_RX  (via drill 0.25)
  Top 0.305: U$10.3 162.56,34.29 v167.64,34.29 179.71,34.29 v180.34,34.92 | v172.72,21.59 v167.64,21.59
  Bottom 0.305: U$29.34 173.99,8.89 173.99,17.78 U$28.34 v172.72,21.59 | v180.34,34.92 IC6.4 | v167.64,21.59 v167.64,34.29
GPS_CAN_TX  (via drill 0.25)
  Top 0.305: U$10.4 164.47,33.66 v166.37,33.66 174.62,33.66 v175.26,33.02 | U$28.32 168.91,20.32 v166.37,20.32
  Bottom 0.203: 176.47,33.02 IC6.1
  Bottom 0.305: v175.26,33.02 176.47,33.02 | U$28.32 171.45,17.78 171.45,8.89 U$29.32 | v166.37,20.32 v166.37,33.66
GPS_MDL_RXDI  (via drill 0.25)
  Top 0.203: v129.54,17.78 133.35,17.78 U$28.3
  Top 0.305: U$28.3 135.89,15.24 135.89,6.35 U$29.3
  Bottom 0.203: v129.54,17.78 U$13.P6
GPS_MDL_TXDO
  Top 0.305: U$28.1 133.35,15.24 133.35,6.35 U$29.1
  Bottom 0.203: U$28.1 130.18,18.41 130.18,29.37 U$13.P5
IRDATA#  (via drill 0.25)
  Top 0.203: IC1.9 v50.16,26.67 | v50.16,21.59 55.88,21.59 56.83,22.54 v87.63,22.54
  Bottom 0.203: v50.16,26.67 v50.16,21.59 | v87.63,22.54 JP1.3
LEDK
  Top 0.406: JP26.7 JP26.8 | JP26.6 JP26.5 | JP26.3 JP26.4
  Bottom 0.406: JP26.7 JP26.5 JP26.3 IC20.3 | JP26.8 JP26.6 JP26.4
LITE_ON  (via drill 0.25)
  Top 0.203: U$30.8 161.93,73.03 v128.27,73.03 | v121.28,82.55 97.79,82.55 95.25,85.09 v79.38,85.09 | v79.38,71.12 26.67,71.12 26.04,71.75 v26.04,79.38
  Top 0.305: U$27.8 165.1,85.09 165.1,76.2 U$30.8
  Bottom 0.203: v128.27,73.03 128.27,76.83 128.06,77.05 R22.1 125.52,77.05 125.09,77.47 121.92,77.47 121.28,78.11 v121.28,82.55 | v79.38,85.09 v79.38,71.12 | IC20.1 25.72,79.69 v26.04,79.38
MST_3V3  (via drill 0.25)
  Top 0.305: U$23.2 72.39,85.09 72.39,76.2 U$24.2 v77.47,74.93 | U$7.1 57.15,67.31 v77.47,67.31 | v78.74,62.23 C3.1
  Bottom 0.305: v78.74,62.23 77.47,63.5 IC10.3 v77.47,67.31 v77.47,74.93
MST_CAN_RX  (via drill 0.25)
  Top 0.305: U$7.3 60.96,66.04 78.11,66.04 v78.74,66.67 | U$24.34 31.75,76.2 31.75,85.09 U$23.34
  Bottom 0.203: U$24.34 30.48,71.75 30.8,71.44 56.83,71.44 57.15,71.12 57.15,62.23 U$7.3
  Bottom 0.305: 78.8,64.77 IC10.4 v78.74,66.67
MST_CAN_TX  (via drill 0.25)
  Top 0.305: U$7.4 62.87,65.41 73.03,65.41 v73.66,64.77 | U$24.32 34.29,76.2 34.29,85.09 U$23.32
  Bottom 0.203: U$24.32 33.02,72.39 33.34,72.07 57.15,72.07 57.78,71.44 57.78,60.33 U$7.4
  Bottom 0.305: v73.66,64.77 74.87,64.77 IC10.1
MTR_3V3  (via drill 0.25)
  Top 0.305: v240.03,27.3 v233.68,27.3 v219.71,27.3 | v240.03,34.29 U$11.1 260.35,35.56 v266.7,35.56 v280.04,35.56 | v281.31,30.48 C7.1 | v205.1,73.66 v205.1,68.58 205.1,59.69 | 205.1,59.69 v205.1,58.42 | 205.1,59.69 v219.71,59.69
  Bottom 0.305: U$26.2 234.95,8.89 234.95,17.78 U$25.2 v233.68,27.3 | v240.03,27.3 U$12.10 v240.03,34.29 | v219.71,27.3 U$12.2 v219.71,59.69 | v280.04,35.56 IC7.3 280.04,31.75 v281.31,30.48 285.75,30.48 286.17,30.06 R13.2 285.12,13.97 284.48,13.34 JP20.1 | R15.1 267.55,36.41 v266.7,35.56 | R9.1 v205.1,73.66 JP22.1 | R10.1 v205.1,68.58 | C9.1 v205.1,58.42
MTR_CAN_RX  (via drill 0.25)
  Top 0.305: U$11.3 264.16,34.29 280.67,34.29 v281.31,34.92
  Bottom 0.203: U$25.20 256.54,26.67 U$11.3
  Bottom 0.305: U$25.20 257.81,17.78 257.81,8.89 U$26.20 | v281.31,34.92 IC7.4
MTR_CAN_TX  (via drill 0.25)
  Top 0.305: U$11.4 266.06,33.66 275.59,33.66 v276.23,33.02
  Bottom 0.305: U$26.22 260.35,8.89 260.35,17.78 U$25.22 U$11.4 | v276.23,33.02 277.44,33.02 IC7.1
MTR_MISO  (via drill 0.25)
  Top 0.203: U$25.7 240.03,17.78 v240.03,21.59 | v241.3,30.48 238.76,30.48 U$12.9
  Top 0.305: U$25.7 242.57,15.24 242.57,6.35 U$26.7
  Bottom 0.203: v240.03,21.59 241.3,22.86 v241.3,30.48
MTR_MOSI  (via drill 0.25)
  Top 0.203: U$25.9 242.57,17.78 v242.57,21.59 | v245.11,31.11 234.31,31.11 U$12.7
  Top 0.305: U$25.9 245.11,15.24 245.11,6.35 U$26.9
  Bottom 0.203: v242.57,21.59 245.11,24.13 v245.11,31.11
MTR_MOTOR_CS  (via drill 0.25)
  Top 0.203: U$25.11 245.11,17.78 v245.11,21.59 | v247.01,59.05 264.8,59.05 IC22.3
  Top 0.305: U$25.11 247.65,15.24 247.65,6.35 U$26.11
  Bottom 0.203: v245.11,21.59 247.01,23.5 v247.01,59.05
MTR_MOTOR_DIR  (via drill 0.25)
  Top 0.203: v251.46,50.8 v256.54,50.8
  Bottom 0.203: U$25.16 v251.46,50.8 | v256.54,50.8 IC22.7
  Bottom 0.305: U$25.16 252.73,17.78 252.73,8.89 U$26.16
MTR_MOTOR_EN#  (via drill 0.25)
  Top 0.203: v209.55,72.39 v248.92,72.39
  Bottom 0.203: v209.55,72.39 202.56,72.39 202.35,72.61 R9.2 JP21.1 | v248.92,72.39 U$25.14
  Bottom 0.305: U$25.14 250.19,17.78 250.19,8.89 U$26.14
MTR_MOTOR_FLT#  (via drill 0.25)
  Top 0.203: U$25.17 255.27,17.78 v255.27,21.59 | v255.27,53.34 v264.16,53.34
  Top 0.305: U$25.17 255.27,15.24 255.27,6.35 U$26.17
  Bottom 0.203: IC22.4 v264.16,53.34 R15.2 | v255.27,21.59 v255.27,53.34
MTR_MOTOR_PWM  (via drill 0.25)
  Top 0.203: v246.38,50.16 v259.08,50.16 | v209.55,69.85 v246.38,69.85 | v242.57,25.4 v246.38,25.4
  Bottom 0.203: v246.38,25.4 246.38,40.01 | 246.38,40.01 v246.38,50.16 v246.38,69.85 | R1.2 246.16,40.22 246.38,40.01 | IC22.6 v259.08,50.16 | v209.55,69.85 202.56,69.85 202.35,70.06 R11.1 JP21.2 | U$25.8 241.3,21.59 242.57,22.86 v242.57,25.4
  Bottom 0.305: U$25.8 242.57,17.78 242.57,8.89 U$26.8
MTR_SCK  (via drill 0.25)
  Top 0.203: U$25.5 237.49,17.78 237.49,20.95 236.85,21.59 v234.95,21.59
  Top 0.305: U$25.5 240.03,15.24 240.03,6.35 U$26.5
  Bottom 0.203: U$12.8 v234.95,21.59
MTR_SD_CS#  (via drill 0.25)
  Top 0.203: U$25.27 265.43,17.78 265.43,24.13 264.8,24.77 v227.33,24.77
  Top 0.305: U$25.27 267.97,15.24 267.97,6.35 U$26.27
  Bottom 0.203: v227.33,24.77 U$12.5
MTR_STEER_EN#  (via drill 0.25)
  Top 0.203: v209.55,67.31 v247.65,67.31
  Bottom 0.203: v209.55,67.31 202.56,67.31 202.35,67.53 R10.2 JP21.3 | v247.65,67.31 247.65,20.32 U$25.12
  Bottom 0.305: U$25.12 247.65,17.78 247.65,8.89 U$26.12
MTR_STEER_PWM  (via drill 0.25)
  Top 0.203: v238.76,81.28 v220.98,81.28 | v209.55,64.77 v238.76,64.77
  Bottom 0.203: U$25.6 238.76,40.01 | R21.2 238.54,40.22 238.76,40.01 | 238.76,40.01 v238.76,64.77 v238.76,81.28 | v220.98,81.28 JP19.1 | v209.55,64.77 202.56,64.77 202.35,64.98 R12.1 JP21.4
  Bottom 0.305: U$25.6 240.03,17.78 240.03,8.89 U$26.6
MTR_TACH#
  Bottom 0.305: U$25.18 255.27,17.78 255.27,8.89 U$26.18 255.27,6.35 255.27,3.81 255.91,3.17 288.93,3.17 289.56,3.81 JP20.3 289.56,13.34 288.93,13.97 R13.1
MTR_TFT_CS#  (via drill 0.25)
  Top 0.203: U$25.25 262.89,17.78 262.89,23.5 262.25,24.13 v229.87,24.13
  Top 0.305: U$25.25 265.43,15.24 265.43,6.35 U$26.25
  Bottom 0.203: v229.87,24.13 U$12.6
MTR_TFT_D/C#  (via drill 0.25)
  Top 0.203: U$25.23 260.35,17.78 260.35,22.86 259.71,23.5 v224.79,23.5
  Top 0.305: U$25.23 262.89,15.24 262.89,6.35 U$26.23
  Bottom 0.203: v224.79,23.5 U$12.4
MTR_TFT_RESET#  (via drill 0.25)
  Top 0.203: U$25.21 257.81,17.78 257.81,22.23 257.18,22.86 v222.25,22.86
  Top 0.305: U$25.21 260.35,15.24 260.35,6.35 U$26.21
  Bottom 0.203: v222.25,22.86 U$12.3
N$1  (via drill 0.25)
  Top 0.305: R5.1 v74.93,57.78
  Bottom 0.305: v74.93,57.78 IC10.8
N$2  (via drill 0.25)
  Top 0.305: R4.1 v74.93,26.04
  Bottom 0.305: v74.93,26.04 IC2.8
N$3  (via drill 0.25)
  Top 0.305: R7.1 v176.53,26.04
  Bottom 0.305: v176.53,26.04 IC6.8
N$4  (via drill 0.25)
  Top 0.305: v277.5,26.04 R8.1
  Bottom 0.305: IC7.8 v277.5,26.04
N$5  (via drill 0.25)
  Top 0.305: R6.1 v175.9,57.78
  Bottom 0.305: v175.9,57.78 IC8.8
N$6  (via drill 0.25)
  Top 0.305: v289.56,87 LED2.A
  Bottom 0.305: v289.56,87 R2.1
N$7
  Bottom 0.406: IC22.10 256.12,66.04 R20.1
N$8
  Top 0.406: R23.1 LED1.A
N$9
  Top 0.406: R28.1 LED3.A
N$10
  Top 0.406: R29.1 LED4.A
N$11
  Top 0.406: R30.1 LED5.A
N$12  (via drill 0.25)
  Top 0.305: v284.8,59.05 v284.8,66.04
  Bottom 0.305: R18.1 v284.8,66.04 278.13,66.04 277.5,65.41 IC9.2 | R17.2 285.43,58.42 v284.8,59.05
N$13
  Bottom 0.406: JP34.1 JP35.1
N$14
  Top 0.305: U$25.1 234.95,15.24 234.95,6.35 U$26.1
N$15
  Top 0.305: U$25.3 237.49,15.24 237.49,6.35 U$26.3
N$16
  Bottom 0.406: JP33.1 JP29.1
N$17
  Bottom 0.406: JP28.1 JP32.1
N$18
  Bottom 0.406: JP31.1 JP27.1
N$19
  Bottom 0.406: JP30.1 JP25.1
N$23
  Top 0.305: U$25.13 250.19,15.24 250.19,6.35 U$26.13
N$24
  Top 0.305: U$25.15 252.73,15.24 252.73,6.35 U$26.15
N$26
  Top 0.305: U$25.19 257.81,15.24 257.81,6.35 U$26.19
N$54
  Top 0.305: U$25.29 270.51,15.24 270.51,6.35 U$26.29
N$55
  Top 0.305: U$25.31 273.05,15.24 273.05,6.35 U$26.31
N$56
  Bottom 0.305: U$27.1 172.72,87.63 172.72,78.74 U$30.1
N$57
  Bottom 0.305: U$27.3 170.18,87.63 170.18,78.74 U$30.3
N$58
  Bottom 0.305: U$27.5 167.64,87.63 167.64,78.74 U$30.5
N$74
  Bottom 0.305: U$25.10 245.11,17.78 245.11,8.89 U$26.10
N$81
  Bottom 0.305: U$25.24 262.89,17.78 262.89,8.89 U$26.24
N$82
  Bottom 0.305: U$25.26 265.43,17.78 265.43,8.89 U$26.26
N$83
  Bottom 0.305: U$25.28 267.97,17.78 267.97,8.89 U$26.28
N$84
  Bottom 0.305: U$25.30 270.51,17.78 270.51,8.89 U$26.30
N$85
  Bottom 0.305: U$25.32 273.05,17.78 273.05,8.89 U$26.32
N$86
  Bottom 0.305: U$25.34 275.59,17.78 275.59,8.89 U$26.34
N$87
  Bottom 0.305: U$27.7 165.1,87.63 165.1,78.74 U$30.7
N$88
  Bottom 0.305: U$27.9 162.56,87.63 162.56,78.74 U$30.9
N$89
  Bottom 0.305: U$27.11 160.02,87.63 160.02,78.74 U$30.11
N$90
  Bottom 0.305: U$27.13 157.48,87.63 157.48,78.74 U$30.13
N$91
  Bottom 0.305: U$27.15 154.94,87.63 154.94,78.74 U$30.15
N$94
  Bottom 0.305: U$27.21 147.32,87.63 147.32,78.74 U$30.21
N$95
  Bottom 0.305: U$27.23 144.78,87.63 144.78,78.74 U$30.23
N$96
  Bottom 0.305: U$27.25 142.24,87.63 142.24,78.74 U$30.25
N$97
  Bottom 0.305: U$27.27 139.7,87.63 139.7,78.74 U$30.27
N$98
  Bottom 0.305: U$27.29 137.16,87.63 137.16,78.74 U$30.29
N$99
  Bottom 0.305: U$27.31 134.62,87.63 134.62,78.74 U$30.31
N$105
  Top 0.305: U$27.10 162.56,85.09 162.56,76.2 U$30.10
N$106
  Top 0.305: U$27.12 160.02,85.09 160.02,76.2 U$30.12
N$121
  Top 0.305: U$27.14 157.48,85.09 157.48,76.2 U$30.14
N$122
  Top 0.305: U$27.16 154.94,85.09 154.94,76.2 U$30.16
N$124
  Top 0.305: U$27.18 152.4,85.09 152.4,76.2 U$30.18
N$125
  Top 0.305: U$27.20 149.86,85.09 149.86,76.2 U$30.20
N$191
  Bottom 0.305: R17.1 287.87,56.73 287.65,56.52 286.38,56.52 286.17,56.3 R16.2 286.17,53.12 285.75,52.7 280.04,52.7 279.4,53.34 IC9.1
N$192
  Bottom 0.305: U$23.1 72.39,87.63 72.39,78.74 U$24.1
N$193
  Bottom 0.305: U$23.3 69.85,87.63 69.85,78.74 U$24.3
N$209
  Bottom 0.305: U$23.5 67.31,87.63 67.31,78.74 U$24.5
N$210
  Bottom 0.305: U$23.7 64.77,87.63 64.77,78.74 U$24.7
N$211
  Bottom 0.305: U$19.18 52.07,17.78 52.07,8.89 U$20.18
N$216
  Bottom 0.305: U$19.20 54.61,17.78 54.61,8.89 U$20.20
N$217
  Bottom 0.305: U$19.22 57.15,17.78 57.15,8.89 U$20.22
N$218
  Bottom 0.305: U$19.24 59.69,17.78 59.69,8.89 U$20.24
N$219
  Bottom 0.305: U$19.26 62.23,17.78 62.23,8.89 U$20.26
N$220
  Bottom 0.305: U$19.28 64.77,17.78 64.77,8.89 U$20.28
N$221
  Bottom 0.305: U$19.30 67.31,17.78 67.31,8.89 U$20.30
N$224
  Top 0.305: U$19.1 31.75,15.24 31.75,6.35 U$20.1
N$225
  Top 0.305: U$19.3 34.29,15.24 34.29,6.35 U$20.3
N$226
  Top 0.305: U$19.5 36.83,15.24 36.83,6.35 U$20.5
N$227
  Top 0.305: U$19.7 39.37,15.24 39.37,6.35 U$20.7
N$228
  Top 0.305: U$19.9 41.91,15.24 41.91,6.35 U$20.9
N$230
  Top 0.305: U$19.13 46.99,15.24 46.99,6.35 U$20.13
N$231
  Top 0.305: U$19.15 49.53,15.24 49.53,6.35 U$20.15
N$232
  Top 0.305: U$19.17 52.07,15.24 52.07,6.35 U$20.17
N$233
  Top 0.305: U$19.19 54.61,15.24 54.61,6.35 U$20.19
N$234
  Top 0.305: U$19.21 57.15,15.24 57.15,6.35 U$20.21
N$235
  Top 0.305: U$19.23 59.69,15.24 59.69,6.35 U$20.23
N$236
  Top 0.305: U$19.25 62.23,15.24 62.23,6.35 U$20.25
N$237
  Bottom 0.305: U$23.9 62.23,87.63 62.23,78.74 U$24.9
N$240
  Bottom 0.305: U$23.11 59.69,87.63 59.69,78.74 U$24.11
N$247
  Bottom 0.305: U$23.13 57.15,87.63 57.15,78.74 U$24.13
N$248
  Bottom 0.305: U$23.15 54.61,87.63 54.61,78.74 U$24.15
N$249
  Bottom 0.305: U$23.17 52.07,87.63 52.07,78.74 U$24.17
N$250
  Bottom 0.305: U$23.19 49.53,87.63 49.53,78.74 U$24.19
N$251
  Bottom 0.305: U$23.21 46.99,87.63 46.99,78.74 U$24.21
N$252
  Bottom 0.305: U$23.23 44.45,87.63 44.45,78.74 U$24.23
N$253
  Bottom 0.305: U$23.25 41.91,87.63 41.91,78.74 U$24.25
N$254
  Bottom 0.305: U$23.27 39.37,87.63 39.37,78.74 U$24.27
N$255
  Bottom 0.305: U$23.29 36.83,87.63 36.83,78.74 U$24.29
N$256
  Bottom 0.305: U$23.31 34.29,87.63 34.29,78.74 U$24.31
N$257
  Top 0.305: U$27.26 142.24,85.09 142.24,76.2 U$30.26
N$258
  Top 0.305: U$27.28 139.7,85.09 139.7,76.2 U$30.28
N$259
  Top 0.305: U$27.30 137.16,85.09 137.16,76.2 U$30.30
N$260
  Top 0.305: U$24.6 67.31,76.2 67.31,85.09 U$23.6
N$261
  Top 0.305: U$24.8 64.77,76.2 64.77,85.09 U$23.8
N$262
  Top 0.305: U$24.10 62.23,76.2 62.23,85.09 U$23.10
N$263
  Top 0.305: U$24.12 59.69,76.2 59.69,85.09 U$23.12
N$264
  Top 0.305: U$24.14 57.15,76.2 57.15,85.09 U$23.14
N$265
  Top 0.305: U$24.16 54.61,76.2 54.61,85.09 U$23.16
N$266
  Top 0.305: U$24.18 52.07,76.2 52.07,85.09 U$23.18
N$267
  Top 0.305: U$24.20 49.53,76.2 49.53,85.09 U$23.20
N$268
  Top 0.305: U$24.22 46.99,76.2 46.99,85.09 U$23.22
N$269
  Top 0.305: U$24.24 44.45,76.2 44.45,85.09 U$23.24
N$270
  Top 0.305: U$24.26 41.91,76.2 41.91,85.09 U$23.26
N$271
  Top 0.305: U$24.28 39.37,76.2 39.37,85.09 U$23.28
N$272
  Top 0.305: U$24.30 36.83,76.2 36.83,85.09 U$23.30
N$279
  Top 0.305: U$28.5 138.43,15.24 138.43,6.35 U$29.5
N$280
  Top 0.305: U$28.7 140.97,15.24 140.97,6.35 U$29.7
N$281
  Top 0.305: U$28.9 143.51,15.24 143.51,6.35 U$29.9
N$282
  Top 0.305: U$28.11 146.05,15.24 146.05,6.35 U$29.11
N$283
  Top 0.305: U$28.13 148.59,15.24 148.59,6.35 U$29.13
N$284
  Top 0.305: U$28.15 151.13,15.24 151.13,6.35 U$29.15
N$285
  Top 0.305: U$28.17 153.67,15.24 153.67,6.35 U$29.17
N$286
  Top 0.305: U$28.19 156.21,15.24 156.21,6.35 U$29.19
N$287
  Top 0.305: U$28.21 158.75,15.24 158.75,6.35 U$29.21
N$288
  Top 0.305: U$28.23 161.29,15.24 161.29,6.35 U$29.23
N$289
  Top 0.305: U$28.25 163.83,15.24 163.83,6.35 U$29.25
N$290
  Top 0.305: U$28.27 166.37,15.24 166.37,6.35 U$29.27
N$291
  Top 0.305: U$28.29 168.91,15.24 168.91,6.35 U$29.29
N$292
  Top 0.305: U$28.31 171.45,15.24 171.45,6.35 U$29.31
N$296
  Bottom 0.305: U$28.6 138.43,17.78 138.43,8.89 U$29.6
N$297
  Bottom 0.305: U$28.8 140.97,17.78 140.97,8.89 U$29.8
N$298
  Bottom 0.305: U$28.10 143.51,17.78 143.51,8.89 U$29.10
N$299
  Bottom 0.305: U$28.12 146.05,17.78 146.05,8.89 U$29.12
N$300
  Bottom 0.305: U$28.14 148.59,17.78 148.59,8.89 U$29.14
N$301
  Bottom 0.305: U$28.16 151.13,17.78 151.13,8.89 U$29.16
N$302
  Bottom 0.305: U$28.18 153.67,17.78 153.67,8.89 U$29.18
N$303
  Bottom 0.305: U$28.20 156.21,17.78 156.21,8.89 U$29.20
N$304
  Bottom 0.305: U$28.22 158.75,17.78 158.75,8.89 U$29.22
N$305
  Bottom 0.305: U$28.24 161.29,17.78 161.29,8.89 U$29.24
N$306
  Bottom 0.305: U$28.26 163.83,17.78 163.83,8.89 U$29.26
N$307
  Bottom 0.305: U$28.28 166.37,17.78 166.37,8.89 U$29.28
N$308
  Bottom 0.305: U$28.30 168.91,17.78 168.91,8.89 U$29.30
OUT3  (via drill 0.25)
  Top 0.203: IC4.7 v24.77,29.21 | JP23.1 v24.77,21.59 26.04,20.32 v41.91,20.32
  Bottom 0.203: v24.77,29.21 v24.77,21.59 | IC1.3 41.91,38.1 v41.91,20.32
OUT7  (via drill 0.25)
  Top 0.203: IC4.12 30.48,34.29 29.21,35.56 v24.13,35.56 | JP23.2 19.05,22.86 v24.13,22.86 | v36.83,40.64 v46.99,40.64
  Bottom 0.203: v24.13,22.86 v24.13,35.56 | IC4.12 36.83,35.56 v36.83,40.64 | v46.99,40.64 46.99,38.1 IC1.13
OUTA
  Bottom 1.016: IC22.15 IC22.16
OUTB
  Bottom 1.016: IC22.13 IC22.14
SFC_ECHO  (via drill 0.25)
  Top 0.203: JP14.6 v8.26,52.07 | v8.26,47.62 24.13,47.62 25.4,48.9 v38.1,48.9 | JP12.5 v8.26,63.5 | v38.1,34.29 IC1.5
  Bottom 0.203: v8.26,47.62 v8.26,52.07 v8.26,63.5 | v38.1,48.9 v38.1,34.29
SFC_TRG  (via drill 0.25)
  Top 0.203: JP14.4 v21.59,46.99 | IC4.5 JP8.3 | v21.59,63.5 JP12.6
  Bottom 0.203: JP8.3 21.59,35.56 v21.59,46.99 v21.59,63.5
SFL_ECHO  (via drill 0.25)
  Top 0.203: JP13.6 v10.16,74.93 | v10.16,48.9 24.13,48.9 24.77,49.53 v38.73,49.53 | JP12.3 v10.16,66.04 | v38.73,31.75 IC1.6
  Bottom 0.203: v10.16,74.93 v10.16,66.04 v10.16,48.9 | v38.73,49.53 v38.73,31.75
SFL_TRG  (via drill 0.25)
  Top 0.203: JP13.4 v9.53,69.85 | v9.53,48.26 v20.32,48.26 | IC4.4 JP2.3 | v9.53,67.31 16.51,67.31 JP12.4
  Bottom 0.203: v9.53,69.85 v9.53,67.31 v9.53,48.26 | JP2.3 v20.32,48.26
SFR_ECHO  (via drill 0.25)
  Top 0.203: JP15.6 v9.53,29.21 | v9.53,46.35 24.13,46.35 26.04,48.26 v39.37,48.26 | JP12.7 v8.89,60.96
  Bottom 0.203: v9.53,29.21 v9.53,46.35 8.89,46.99 v8.89,60.96 | IC1.4 39.37,38.1 v39.37,48.26
SFR_TRG  (via drill 0.25)
  Top 0.203: JP15.4 v10.16,24.13 | v10.16,45.72 v22.86,45.72 | IC4.6 v22.86,31.75 JP9.3 | v22.86,60.96 JP12.8
  Bottom 0.203: v10.16,24.13 v10.16,45.72 | v22.86,31.75 v22.86,45.72 v22.86,60.96
SNS_3V3  (via drill 0.25)
  Top 0.305: v33.02,60.96 33.73,60.25 IMU_MDL.P3 54.05,60.25 v54.61,59.69 | U$9.1 57.15,35.56 v77.47,35.56 | v78.74,30.48 C5.1 | v54.61,22.86 v30.48,22.86
  Bottom 0.305: v30.48,22.86 U$19.2 31.75,17.78 31.75,8.89 U$20.2 | v33.02,60.96 JP11.3 | v77.47,35.56 IC2.3 77.47,31.75 v78.74,30.48 | v54.61,22.86 54.61,33.02 U$9.1 54.61,35.56 v54.61,59.69
SNS_CAN_RX  (via drill 0.25)
  Top 0.305: U$9.3 60.96,34.29 v66.04,34.29 78.11,34.29 v78.74,34.92
  Bottom 0.305: U$20.34 72.39,8.89 72.39,17.78 U$19.34 66.04,24.13 v66.04,34.29 | v78.74,34.92 IC2.4
SNS_CAN_TX  (via drill 0.25)
  Top 0.305: U$9.4 62.87,33.66 v65.41,33.66 73.03,33.66 v73.66,33.02
  Bottom 0.305: U$20.32 69.85,8.89 69.85,17.78 U$19.32 65.41,22.23 v65.41,33.66 | v73.66,33.02 74.87,33.02 IC2.1
SNS_DIN  (via drill 0.25)
  Top 0.203: IC4.13 36.83,35.56 v43.18,35.56
  Bottom 0.203: v43.18,35.56 U$19.12
  Bottom 0.305: U$19.12 44.45,17.78 44.45,8.89 U$20.12
SNS_DOUT
  Bottom 0.305: U$19.16 49.53,17.78 49.53,8.89 U$20.16
SNS_ECHO_CAP  (via drill 0.25)
  Top 0.203: U$19.27 62.23,17.78 v62.23,20.95 v52.7,20.95 | IC1.7 43.18,29.21 44.45,27.94 v52.7,27.94
  Top 0.305: U$19.27 64.77,15.24 64.77,6.35 U$20.27
  Bottom 0.203: v52.7,27.94 v52.7,20.95
SNS_LE  (via drill 0.25)
  Top 0.203: IC4.14 36.83,38.1 43.18,38.1 v45.72,35.56
  Bottom 0.203: v45.72,35.56 U$19.14
  Bottom 0.305: U$19.14 46.99,17.78 46.99,8.89 U$20.14
SNS_SCL  (via drill 0.25)
  Top 0.203: v85.09,36.83 v53.34,36.83 | v53.34,57.78 v44.45,57.78 | v44.45,65.41 41.99,65.41 IMU_MDL.P1
  Top 0.305: IMU_MDL.P1 38.18,65.33 JP11.1
  Bottom 0.203: v53.34,36.83 v53.34,57.78 | v44.45,57.78 v44.45,65.41 | JP1.2 v85.09,36.83
SNS_SDA  (via drill 0.25)
  Top 0.203: v82.55,37.47 v53.98,37.47 | v53.98,59.05 v45.72,59.05 | v45.72,62.87 41.99,62.87 IMU_MDL.P2
  Top 0.305: IMU_MDL.P2 36.27,62.79 v35.56,63.5
  Bottom 0.203: v53.98,37.47 v53.98,59.05 | v45.72,59.05 v45.72,62.87 | JP1.1 v82.55,37.47
  Bottom 0.305: v35.56,63.5 JP11.2
SNS_SEL0  (via drill 0.25)
  Top 0.203: v30.48,33.02 v37.47,33.02 v49.53,33.02
  Bottom 0.203: v30.48,33.02 30.48,41.91 IC4.1 | U$19.6 35.56,20.32 37.47,22.23 v37.47,33.02 | v49.53,33.02 49.53,38.1 IC1.14
  Bottom 0.305: U$19.6 36.83,17.78 36.83,8.89 U$20.6
SNS_SEL1  (via drill 0.25)
  Top 0.203: v29.84,30.48 v38.1,30.48 | IC4.2 31.75,41.91 33.02,43.18 36.83,43.18 38.1,41.91 IC1.2
  Bottom 0.203: v29.84,30.48 29.84,40.01 IC4.2 | U$19.8 v38.1,30.48
  Bottom 0.305: U$19.8 39.37,17.78 39.37,8.89 U$20.8
SNS_SEL2  (via drill 0.25)
  Top 0.203: v29.21,27.94 v38.73,27.94
  Bottom 0.203: v29.21,27.94 29.21,38.1 IC4.3 | U$19.10 40.64,20.32 38.73,22.23 v38.73,27.94
  Bottom 0.305: U$19.10 41.91,17.78 41.91,8.89 U$20.10
SRC_ECHO  (via drill 0.25)
  Top 0.203: JP17.6 v295.91,41.91 | v295.91,46.35 295.27,46.99 v50.8,46.99 | JP12.11 16.51,54.61 22.86,54.61 23.5,55.24 v50.8,55.24 | IC1.11 v50.8,31.75
  Bottom 0.203: v295.91,41.91 v295.91,46.35 | v50.8,31.75 v50.8,46.99 v50.8,55.24
SRC_TRG  (via drill 0.25)
  Top 0.203: JP17.4 296.55,46.99 295.91,47.62 49.53,47.62 48.9,46.99 27.3,46.99 24.77,44.45 v16.51,44.45
  Bottom 0.203: JP8.2 16.51,35.56 v16.51,44.45 16.51,54.61 JP12.12
SRL_ECHO  (via drill 0.25)
  Top 0.203: JP16.6 v295.27,66.04 | v295.27,48.9 294.64,48.26 v50.16,48.26 | JP12.9 16.51,57.15 22.86,57.15 24.13,55.88 v50.16,55.88 | IC1.10 v50.16,29.21
  Bottom 0.203: v295.27,66.04 v295.27,48.9 | v50.16,29.21 v50.16,48.26 v50.16,55.88
SRL_TRG  (via drill 0.25)
  Top 0.203: JP16.4 v294.64,71.12 | v294.64,49.53 294,48.9 48.9,48.9 47.62,47.62 26.67,47.62 24.13,45.09 v19.68,45.09 v17.78,45.09
  Bottom 0.203: v294.64,71.12 v294.64,49.53 | v17.78,45.09 JP2.2 | JP12.10 19.68,56.52 v19.68,45.09
SRR_ECHO  (via drill 0.25)
  Top 0.203: JP18.6 v294.64,17.78 | v294.64,45.09 294,45.72 v51.44,45.72 | JP12.13 16.51,52.07 21.59,52.07 24.13,54.61 v51.44,54.61 | IC1.12 v51.44,34.29
  Bottom 0.203: v294.64,17.78 v294.64,45.09 | v51.44,34.29 v51.44,45.72 v51.44,54.61
SRR_TRG  (via drill 0.25)
  Top 0.203: JP18.4 v295.27,22.86 | v295.27,45.72 294.64,46.35 27.94,46.35 25.4,43.81 v19.05,43.81
  Bottom 0.203: v295.27,22.86 v295.27,45.72 | JP9.2 19.05,33.02 v19.05,43.81 19.05,48.26 17.78,49.53 JP12.14
SYSRST#  (via drill 0.25)
  Top 0.203: IC4.15 33.02,41.91 31.75,40.64 v26.67,40.64 | v26.67,12.06 v20.32,12.06
  Bottom 0.203: v26.67,40.64 v26.67,12.06 | v20.32,12.06 20,12.38 IC23.1
USFEN#  (via drill 0.25)
  Top 0.203: IC21.3 92.08,76.83 91.44,76.2 85.09,76.2 v84.45,75.56 | 67.31,15.24 64.77,17.78 64.77,21.27 65.41,21.91 v84.45,21.91
  Top 0.305: U$19.29 67.31,15.24 67.31,6.35 U$20.29
  Top 0.406: v92.08,82.55 IC21.3
  Bottom 0.203: v84.45,75.56 v84.45,21.91
  Bottom 0.406: R26.2 v92.08,82.55
USFOC#
  Top 0.406: R24.2 LED1.C 107.31,75.45 107.31,74.3 106.62,73.6 IC21.8
USFVCC  (via drill 0.25)
  Top 0.406: v2.54,64.77 JP13.2 20.32,64.77 24.13,68.58 v93.34,68.58 v99.06,68.58 | JP14.2 v3.81,41.91 | v3.81,19.05 JP15.2 | v93.34,71.75 IC21.7 | R29.2 v99.06,79.38 | C16.1 96.28,59.3 95.89,59.69 v95.89,61.59
  Bottom 0.406: v3.81,19.05 v3.81,41.91 3.81,58.42 2.54,59.69 v2.54,64.77 | v93.34,68.58 v93.34,71.75 | v99.06,79.38 v99.06,68.58 C19.+ 98.62,61.59 v95.89,61.59 | C15.1 7.86,19.05 JP15.2 | C13.1 7.86,41.91 JP14.2 | JP13.2 4.84,64.77 C14.1
USREN#  (via drill 0.25)
  Top 0.203: IC21.4 83.88,78.8 v83.19,78.11 | 69.85,15.24 67.31,17.78 67.31,20.64 67.94,21.27 v83.19,21.27
  Top 0.305: U$19.31 69.85,15.24 69.85,6.35 U$20.31
  Top 0.406: v90.81,82.55 IC21.4
  Bottom 0.203: v83.19,78.11 v83.19,21.27
  Bottom 0.406: R27.2 89.85,83.5 v90.81,82.55
USROC#  (via drill 0.25)
  Top 0.406: R25.2 LED3.C 107.31,67.83 107.31,66.04 106.68,65.41 v90.81,65.41 | IC21.5 v90.81,71.12
  Bottom 0.406: v90.81,71.12 v90.81,65.41
USRVCC  (via drill 0.25)
  Top 0.406: v300.99,76.2 JP16.2 v213.36,76.2 | JP18.2 v300.99,27.94 | JP17.2 v300.99,52.07 | v213.36,55.88 v130.81,55.88 | IC21.6 v92.08,70.48 96.52,70.48 97.79,71.75 R30.2 | C17.1 87.39,59.3 87,59.69 v87,61.59 | v130.81,64.14 v92.08,64.14
  Bottom 0.406: v300.99,76.2 v300.99,52.07 v300.99,27.94 | v213.36,76.2 v213.36,55.88 | v130.81,55.88 v130.81,64.14 | v92.08,70.48 v92.08,64.14 92.08,63.7 C18.+ 89.97,61.59 v87,61.59 | JP16.2 296.94,76.2 C12.1 | C10.1 296.94,52.07 JP17.2 | C11.1 296.94,27.94 JP18.2
VCC  (via drill 0.25)
  Top 0.305: v32.7,24.13 v12.7,24.13 | v19.05,10.48 18.97,10.48 C4.1 | IC4.16 36.83,44.45 38.1,43.18 46.99,43.18 IC1.16
  Top 0.406: R24.1 R25.1 v119.38,67.94 | R23.2 v97.79,75.56 | v97.79,67.31 99.06,67.31 99.69,67.94 R28.2 | IC21.2 93.34,80.8 v93.19,80.96 | C23.+ v220.98,17.78 | C25.+ v116.2,18.41
  Bottom 0.305: IC4.16 C1.1 32.7,44.37 v32.7,24.13 | 17.78,10.31 IC23.2 v19.05,10.48 | C2.1 IC1.16
  Bottom 0.406: 11.43,11.43 12.7,12.7 v12.7,24.13 | R26.1 92.08,92.71 | R27.1 89.85,92.71 | 93.98,92.71 93.66,92.39 93.66,86.36 93.11,85.8 C20.1 93.19,82.55 v93.19,80.96 95.41,78.74 96.52,78.74 97.79,77.47 v97.79,75.56 v97.79,67.31 | C24.+ 293.37,82.55 | JP35.2 187.96,87.63 187.96,92.71 | JP25.2 87.63,87.63 87.63,92.71 | JP27.2 16.51,8.89 18.73,8.89 19.05,9.21 v19.05,10.48
  Bottom 0.813: 11.43,7.62 11.43,11.43 1.27,11.43 1.27,82.55 11.43,82.55 11.43,92.71 87.63,92.71 89.85,92.71 92.08,92.71 93.98,92.71 119.38,92.71 | 11.43,7.62 11.43,1.27 115.57,1.27 | 115.57,1.27 215.9,1.27 | 215.9,1.27 293.37,1.27 293.37,11.43 303.53,11.43 303.53,82.55 293.37,82.55 293.37,92.71 289.56,92.71 | 289.56,92.71 276.86,92.71 | 276.86,92.71 218.44,92.71 | 218.44,92.71 187.96,92.71 119.38,92.71 | U$22.1 276.86,92.71 | 119.38,92.71 v119.38,67.94 119.38,66.04 116.2,62.87 v116.2,18.41 116.2,9.53 JP28.2 115.57,5.08 115.57,1.27 | 218.44,92.71 218.44,81.28 220.98,78.74 v220.98,17.78 220.98,12.7 218.44,10.16 JP29.2 217.17,7.62 215.9,6.35 215.9,1.27 | R2.2 289.56,92.71 | JP27.2 11.43,7.62

## Text on the board
tPlace: "The Nine" / CMPE-243 Autonomous Car Team / at San Jose State University / ------------------------------ / Bluetooth & Android App: / - Khalil Estell / Global Positioning System: / - Sara Sepasian / Master/Navigation: / - Steven Hwu / - Adam Iglesias / Motors/Drive System: / - Derek Tran / - Matthew Boyd / Sensors / PCB: / - John Strube / - Charles MacDonald / Very Special Thanks: / - Preet Kang / - Calvin L., Shangming W., Jon H. / - Our 243 classmates & ISAs / - Bay Area Circuits
tNames: + | + | GND | OUTB | OUTA | VIN | + | SERVO | MASTER | * | BLUETOOTH | VREF | SENSOR-RR | GND | SENSOR-FR | GPS | BLUETOOTH | GND | DIR | PWM | SLP# | FLT# | CS | 3V3O | VM | HMC-5883L | SENSOR-FC | SENSOR-RC | CAN | SENSOR-FL | SENSOR-RL | TACH | GPS | SENSOR | MOTOR | + | + | +